# Altium schematic sheet Schematic.SchDoc
size A
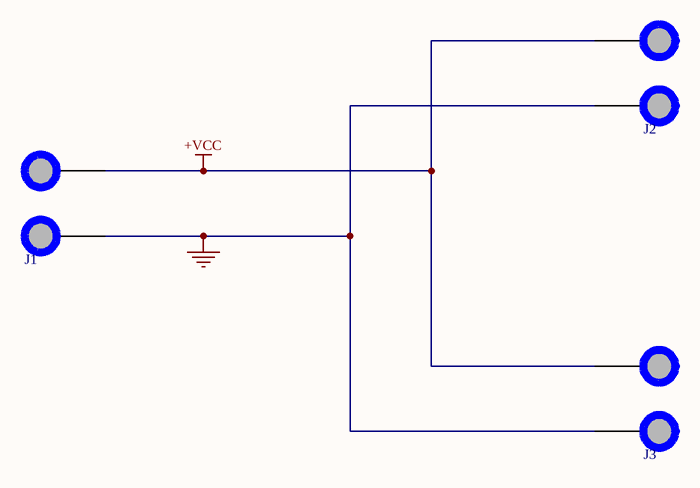
[diagram p0: Schematic.SchDoc]

## Parts
J1  Doublepad  [DOUBLEPAD_WITH_HOLE_4MMx1MM5]  (value not drawn)
J2  Doublepad  [DOUBLEPAD_WITH_HOLE_4MMx1MM5]  (value not drawn)
J3  Doublepad  [DOUBLEPAD_WITH_HOLE_4MMx1MM5]  (value not drawn)

## Nets
+VCC: J1.1 J2.1 J3.1
GND: J1.2 J2.2 J3.2

## Library data of the parts
J1-J3 = DOUBLEPAD_WITH_HOLE_4MMx1MM5